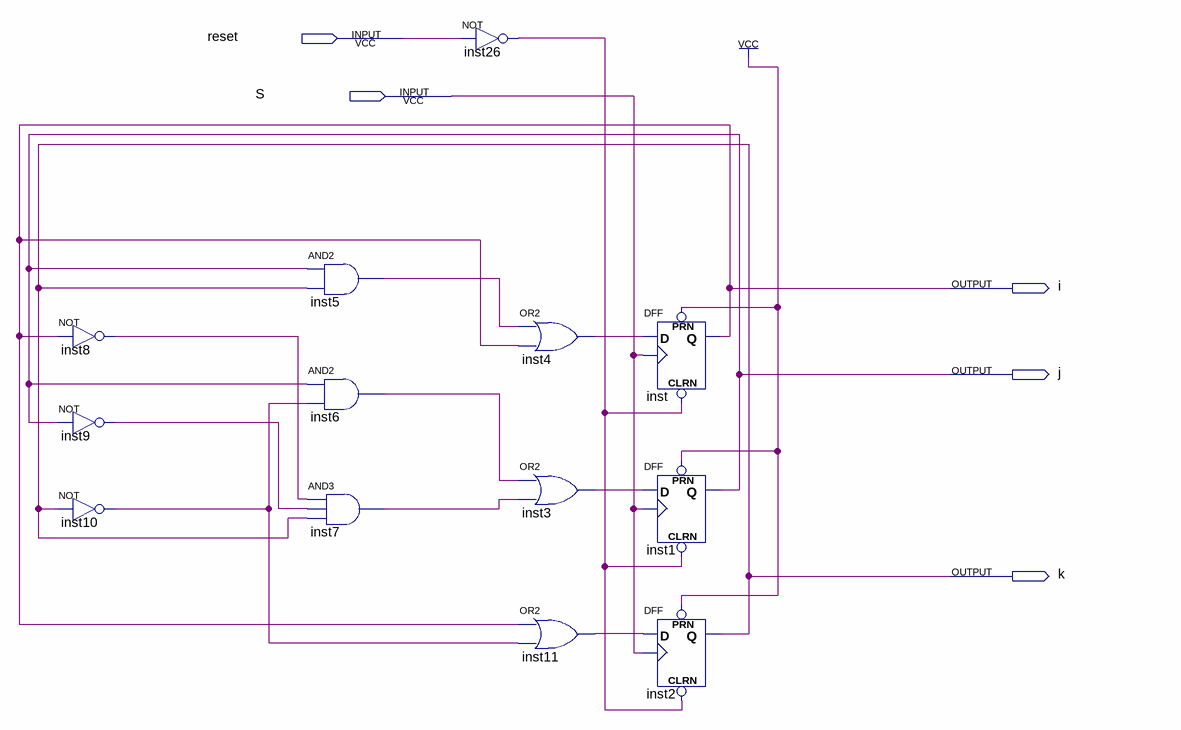
[diagram p0: schematic sheet]
// Quartus schematic 3-bit_score_sm_inclk.bdf as structural Verilog: 13 symbols, 5 pins
module \3-bit_score_sm_inclk  (
  input  reset,
  input  S,
  output i,
  output j,
  output k
);

  wire inst3_out, inst4_out, inst5_out, inst6_out, inst7_out, inst8_out, inst9_out, inst10_out, inst11_out,
       inst26_out;

  not inst8 (inst8_out, i);
  not inst9 (inst9_out, j);
  not inst10 (inst10_out, k);
  and inst5 (inst5_out, j, k);
  and inst6 (inst6_out, j, inst10_out);
  and inst7 (inst7_out, inst8_out, inst9_out, k);
  not inst26 (inst26_out, reset);
  or inst4 (inst4_out, inst5_out, i);
  or inst3 (inst3_out, inst6_out, inst7_out);
  or inst11 (inst11_out, i, inst10_out);
  DFF inst (.CLRN(inst26_out), .CLK(S), .D(inst4_out), .PRN(1'b1), .Q(i));
  DFF inst1 (.CLRN(inst26_out), .CLK(S), .D(inst3_out), .PRN(1'b1), .Q(j));
  DFF inst2 (.CLRN(inst26_out), .CLK(S), .D(inst11_out), .PRN(1'b1), .Q(k));
endmodule
